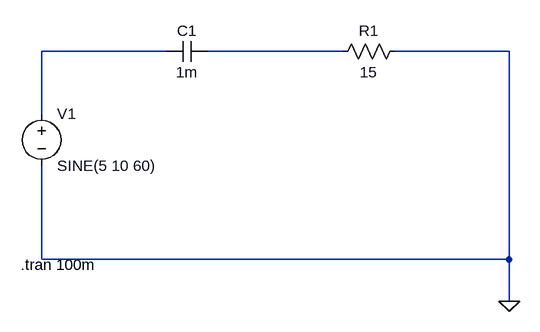
[diagram p0: schematic coupling.asc]
coupling.asc, the LTspice schematic file:
Version 4.1
SHEET 1 880 680
WIRE 160 32 -32 32
WIRE 432 32 224 32
WIRE 688 32 512 32
WIRE -32 128 -32 32
WIRE -32 352 -32 208
WIRE 688 352 688 32
WIRE 688 352 -32 352
WIRE 688 416 688 352
FLAG 688 416 0
SYMBOL voltage -32 112 R0
WINDOW 123 0 0 Left 0
WINDOW 39 0 0 Left 0
SYMATTR InstName V1
SYMATTR Value SINE(5 10 60)
SYMBOL cap 224 16 R90
WINDOW 0 0 32 VBottom 2
WINDOW 3 32 32 VTop 2
SYMATTR InstName C1
SYMATTR Value 1m
SYMBOL res 528 16 R90
WINDOW 0 0 56 VBottom 2
WINDOW 3 32 56 VTop 2
SYMATTR InstName R1
SYMATTR Value 15
TEXT -64 360 Left 2 !.tran 100m

The netlist it stands for:
* coupling.asc
V1 N001 0 SINE(5 10 60)
C1 N002 N001 1m
R1 0 N002 15
.tran 100m
.backanno
.end